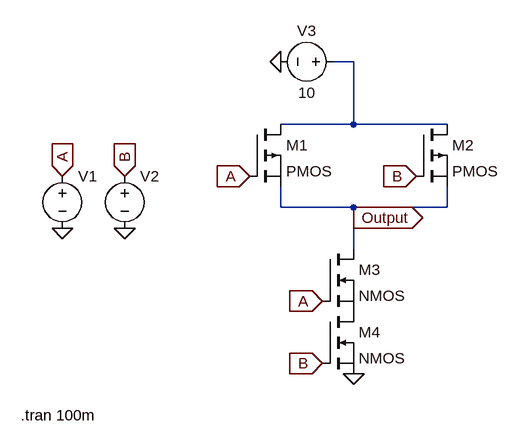
[diagram p0: schematic cmos_nand.asc]
cmos_nand.asc, the LTspice schematic file:
Version 4.1
SHEET 1 880 680
WIRE 208 -32 176 -32
WIRE 208 64 208 -32
WIRE 208 64 96 64
WIRE 352 64 208 64
WIRE 96 192 96 160
WIRE 208 192 96 192
WIRE 352 192 352 160
WIRE 352 192 208 192
WIRE 208 208 208 192
WIRE 208 256 208 208
FLAG 208 448 0
FLAG -240 144 A
IOPIN -240 144 In
FLAG 48 144 A
IOPIN 48 144 In
FLAG 160 336 A
IOPIN 160 336 In
FLAG -144 144 B
IOPIN -144 144 In
FLAG 304 144 B
IOPIN 304 144 In
FLAG 160 432 B
IOPIN 160 432 In
FLAG -144 224 0
FLAG -240 224 0
FLAG 96 -32 0
FLAG 208 208 Output
IOPIN 208 208 Out
SYMBOL nmos 160 256 R0
SYMATTR InstName M3
SYMBOL nmos 160 352 R0
SYMATTR InstName M4
SYMBOL pmos 48 64 R0
SYMATTR InstName M1
SYMBOL pmos 304 64 R0
SYMATTR InstName M2
SYMBOL voltage -240 128 R0
WINDOW 3 24 96 Invisible 2
WINDOW 123 0 0 Left 0
WINDOW 39 0 0 Left 0
SYMATTR InstName V1
SYMATTR Value PULSE(0 10 0 1n 1n 10m 20m)
SYMBOL voltage -144 128 R0
WINDOW 3 24 96 Invisible 2
WINDOW 123 0 0 Left 0
WINDOW 39 0 0 Left 0
SYMATTR InstName V2
SYMATTR Value PULSE(0 10 0 1n 1n 20m 40m)
SYMBOL voltage 192 -32 R90
WINDOW 0 -32 56 VBottom 2
WINDOW 3 32 56 VTop 2
WINDOW 123 0 0 Left 0
WINDOW 39 0 0 Left 0
SYMATTR InstName V3
SYMATTR Value 10
TEXT -304 512 Left 2 !.tran 100m

The netlist it stands for:
* cmos_nand.asc
M3 Output A P001 P001 NMOS
M4 P001 B 0 0 NMOS
M1 N001 A Output Output PMOS
M2 N001 B Output Output PMOS
V1 A 0 PULSE(0 10 0 1n 1n 10m 20m)
V2 B 0 PULSE(0 10 0 1n 1n 20m 40m)
V3 N001 0 10
.model NMOS NMOS
.model PMOS PMOS
.lib standard.mos
.tran 100m
.backanno
.end